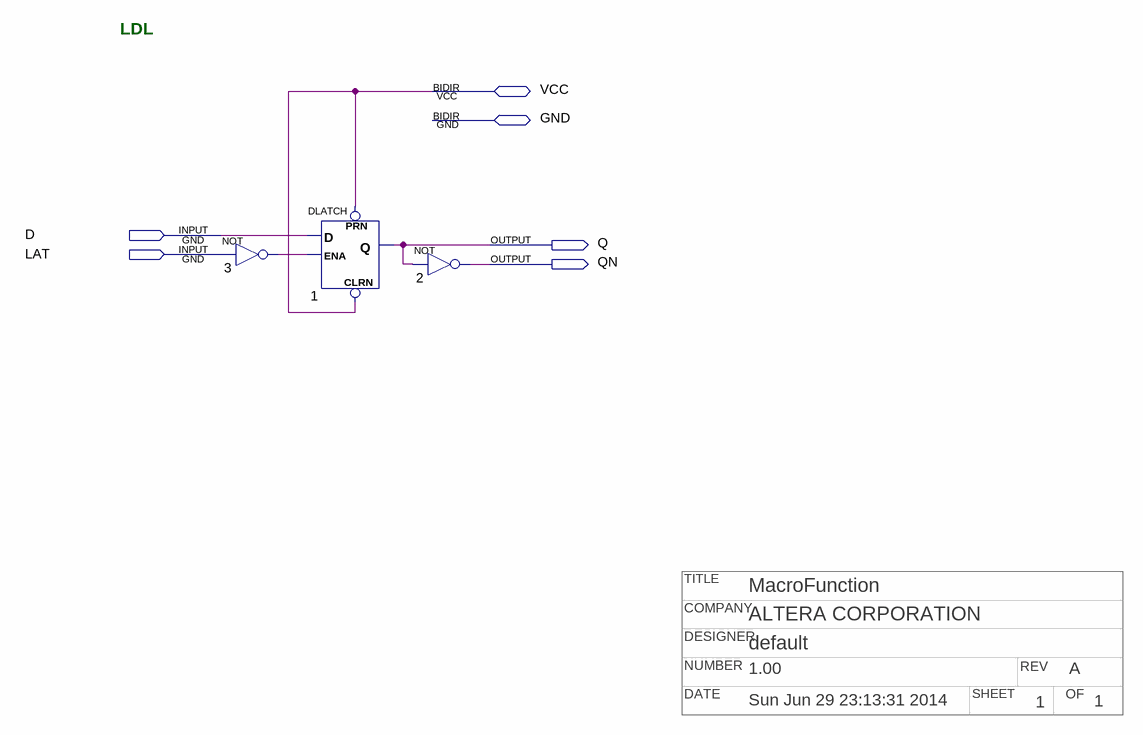
[diagram p0: schematic sheet]
// Quartus schematic npldl.bdf as structural Verilog: 3 symbols, 6 pins
// Title block: TITLE: MacroFunction; COMPANY: ALTERA CORPORATION; DESIGNER: default; NUMBER: 1.00; REV: A; DATE: Sun Jun 29 23:13:31 2014; SHEET: 1; OF: 1
module npldl (
  input  D,
  input  LAT,
  inout  VCC,
  inout  GND,
  output Q,
  output QN
);

  wire n3_out;

  not u_3 (n3_out, LAT);
  DLATCH u_1 (.CLRN(VCC), .D(D), .ENA(n3_out), .PRN(VCC), .Q(Q));
  not u_2 (QN, Q);

  // Notes on the sheet:
  //   LDL
endmodule
